# EAGLE schematic Circuit diagram (EAGLE 9.6.2)
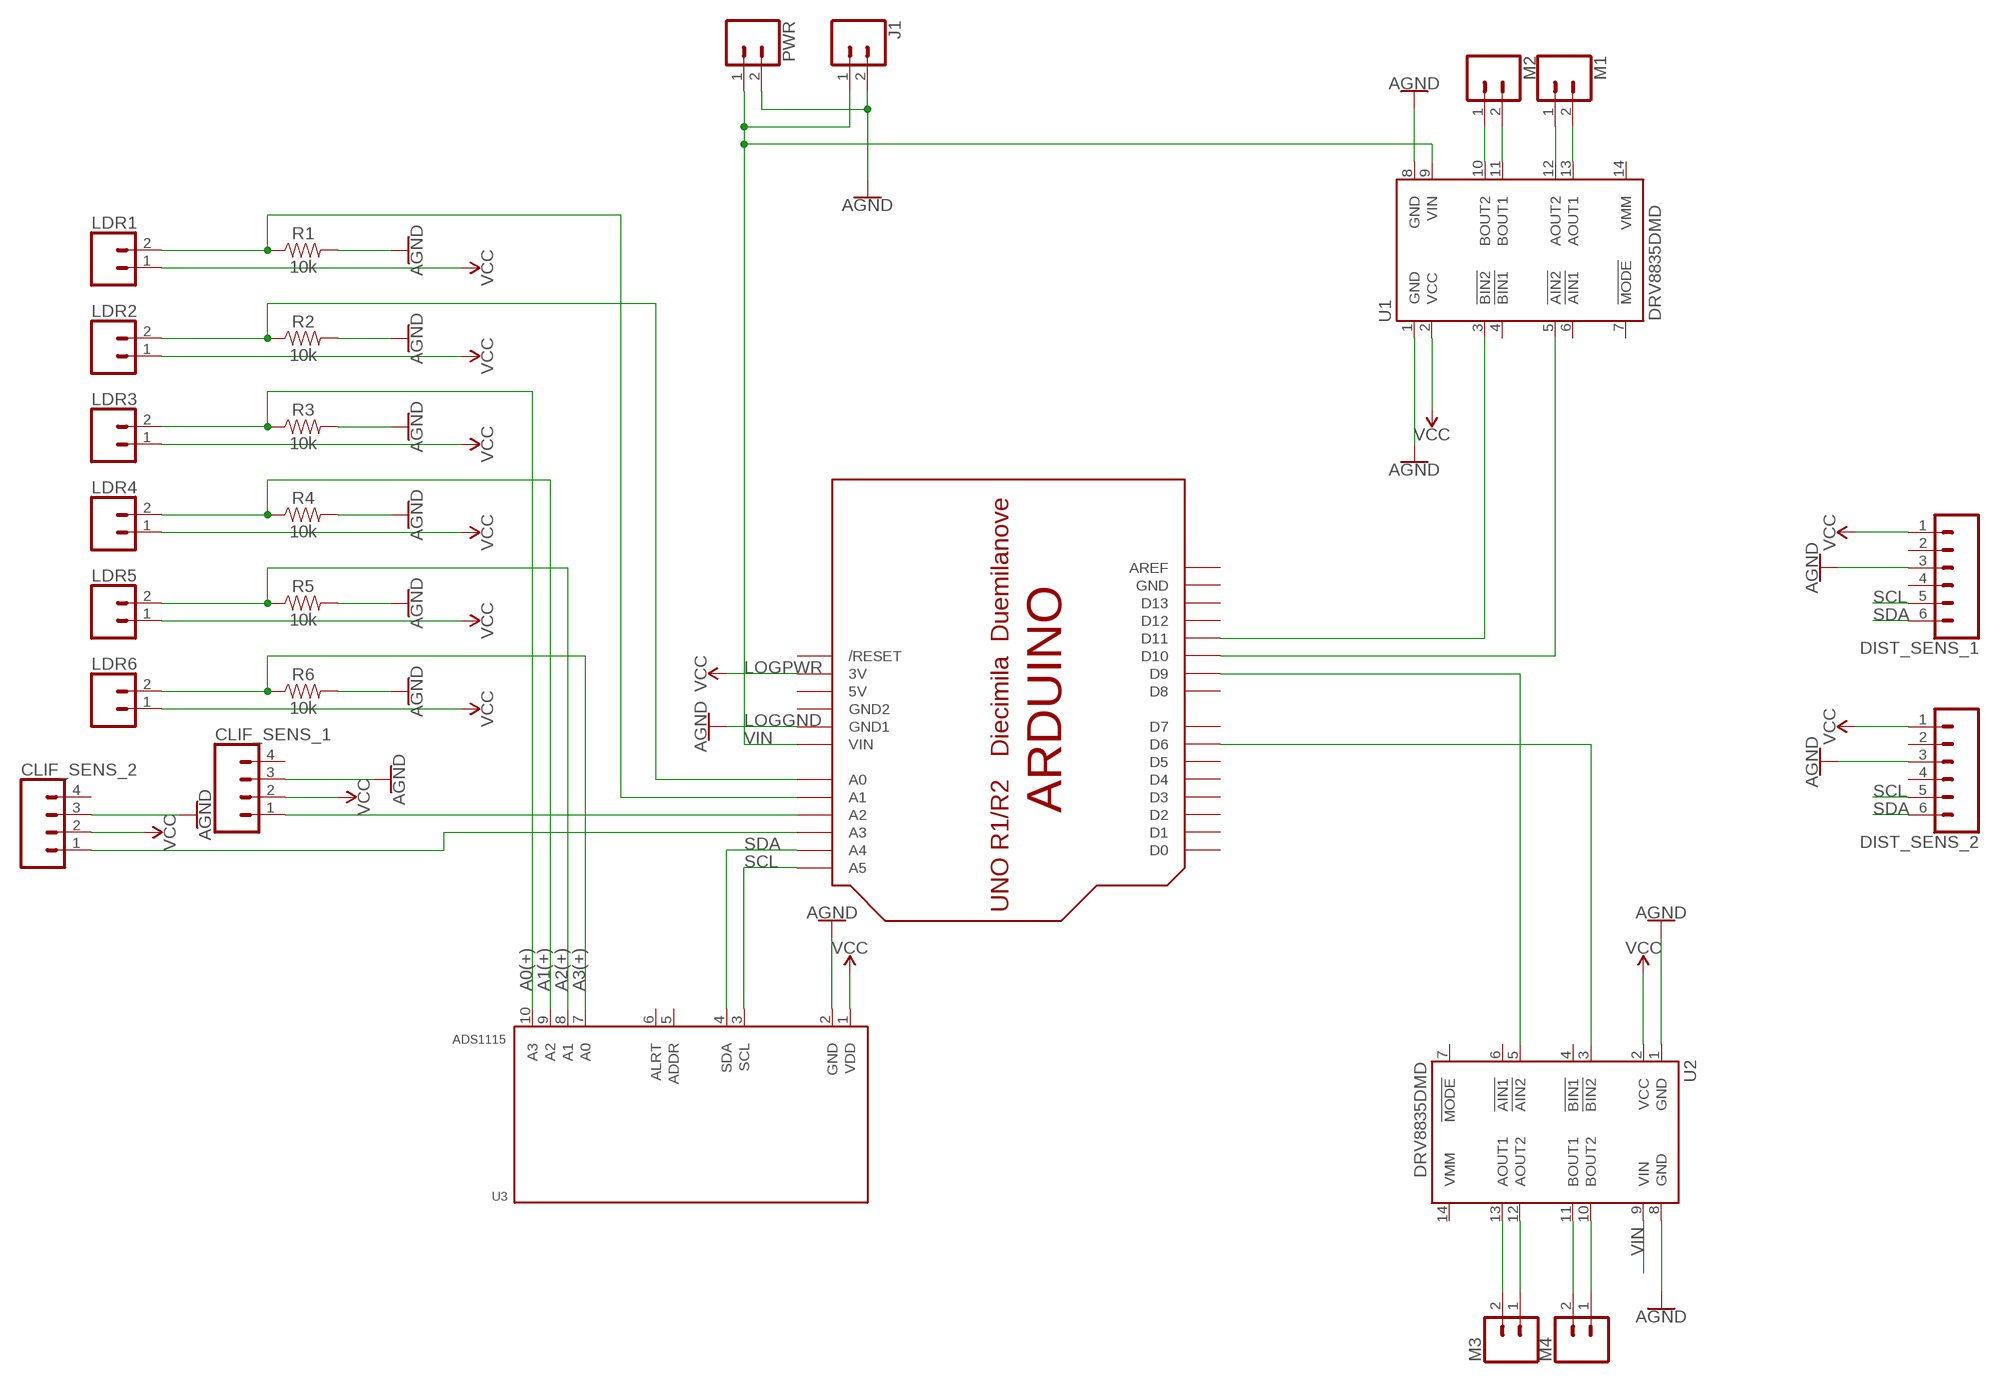
[diagram p0: schematic, sheet 1]

## Parts
CLIF_SENS_1  CONN_04JST-PTH  [JST-4-PTH]
CLIF_SENS_2  CONN_04JST-PTH  [JST-4-PTH]
DIST_SENS_1  CONN_06FEMALE_LOCK  [1X06_FEMALE_LOCK.010]
DIST_SENS_2  CONN_06FEMALE_LOCK  [1X06_FEMALE_LOCK.010]
J1  CONN_02  [1X02]
LDR1  CONN_02  [1X02]
LDR2  CONN_02  [1X02]
LDR3  CONN_02  [1X02]
LDR4  CONN_02  [1X02]
LDR5  CONN_02  [1X02]
LDR6  CONN_02  [1X02]
M1  CONN_02  [1X02]
M2  CONN_02  [1X02]
M3  CONN_02  [1X02]
M4  CONN_02  [1X02]
PWR  CONN_02  [1X02]
R1  10k  10KOHM-0402-1/16W-1%  [0402]
R2  10k  10KOHM-0402-1/16W-1%  [0402]
R3  10k  10KOHM-0402-1/16W-1%  [0402]
R4  10k  10KOHM-0402-1/16W-1%  [0402]
R5  10k  10KOHM-0402-1/16W-1%  [0402]
R6  10k  10KOHM-0402-1/16W-1%  [0402]
U1  DRV8835DMD  [DRV8835DMD]
U2  DRV8835DMD  [DRV8835DMD]
U3  ADS1115  [ADS1115]
U$1  ARDUINOUNO  [ARDUINO]

## Nets
A0(+): LDR3.2 R3.1 U3.10(A3)
A1(+): LDR4.2 R4.1 U3.9(A2)
A2(+): LDR5.2 R5.1 U3.8(A1)
A3(+): LDR6.2 R6.1 U3.7(A0)
AGND: CLIF_SENS_1.3 CLIF_SENS_2.3 DIST_SENS_1.3 DIST_SENS_2.3 J1.2 PWR.2 R1.2 R2.2 R3.2 R4.2 R5.2 R6.2 U1.1(GND) U1.8(GND) U2.1(GND) U2.8(GND) U3.2(GND)
LOGGND: U$1.GND1 ; supply symbol labelled AGND
LOGPWR: U$1.3V ; supply symbol labelled VCC
N$1: LDR1.2 R1.1 U$1.A1
N$2: LDR2.2 R2.1 U$1.A0
N$3: CLIF_SENS_1.1 U$1.A2
N$4: CLIF_SENS_2.1 U$1.A3
N$5: U1.3(!BIN2) U$1.D11
N$6: U1.5(!AIN2) U$1.D10
N$7: M3.2 U2.13(AOUT1)
N$8: M3.1 U2.12(AOUT2)
N$9: M4.2 U2.11(BOUT1)
N$10: M4.1 U2.10(BOUT2)
N$11: M1.2 U1.13(AOUT1)
N$12: M1.1 U1.12(AOUT2)
N$13: M2.2 U1.11(BOUT1)
N$14: M2.1 U1.10(BOUT2)
N$15: U2.5(!AIN2) U$1.D9
N$16: U2.3(!BIN2) U$1.D6
SCL: DIST_SENS_1.5 DIST_SENS_2.5 U3.3(SCL) U$1.A5
SDA: DIST_SENS_1.6 DIST_SENS_2.6 U3.4(SDA) U$1.A4
VCC: CLIF_SENS_1.2 CLIF_SENS_2.2 DIST_SENS_1.1 DIST_SENS_2.1 LDR1.1 LDR2.1 LDR3.1 LDR4.1 LDR5.1 LDR6.1 U1.2(VCC) U2.2(VCC) U3.1(VDD)
VIN: J1.1 PWR.1 U1.9(VIN) U2.9(VIN) U$1.VIN
Unconnected: CLIF_SENS_1.4 CLIF_SENS_2.4 DIST_SENS_1.2 DIST_SENS_1.4 DIST_SENS_2.2 DIST_SENS_2.4 U1.4(!BIN1) U1.6(!AIN1) U1.7(!MODE) U1.14(VMM) U2.4(!BIN1) U2.6(!AIN1) U2.7(!MODE) U2.14(VMM) U3.5(ADDR) U3.6(ALRT) U$1.AREF U$1.D0 U$1.D1 U$1.D2 U$1.D3 U$1.D4 U$1.D5 U$1.D7 U$1.D8 U$1.D12 U$1.D13 U$1.RESET(/RESET)

## Power pins joined to a net without a drawn wire
5V: U$1.5V
GND: U$1.GND
GND2: U$1.GND2

## Library data of the parts
CLIF_SENS_1 CLIF_SENS_2 = SparkFun-Connectors:CONN_04: Multi connection point. Often used as Generic Header-pin footprint for 0.1 inch spaced/style header connections On any of the 0.1 inch spaced packages, you can populate with these: Break Away Headers - Straight <https://www.sparkfun.com/products/116> (PRT-00116) Break Away Male Headers - Right Angle <https://www.sparkfun.com/products/553> (PRT-00553) Female Headers <https://www.sparkfun.com/products/115> (PRT-00115) Break Away Headers - Machine Pin <https://www.sparkfun.com/products/117> (PRT-00117) Break Away Female Headers - Swiss Machine Pin <https://www.sparkfun.com/products/743> (PRT-00743) For SCREWTERMINALS and SPRING TERMINALS visit here: Screw Terimnals on SparkFun.com <https://www.sparkfun.com/search/results?term=Screw+Terminals> (5mm/3.5mm/2.54mm spacing) This device is also useful as a general connection point to wire up your design to another part of your project. Our various solder wires solder well into these plated through hole pads. Hook-Up Wire - Assortment (Stranded, 22 AWG) <https://www.sparkfun.com/products/11375> (PRT-11375) Hook-Up Wire - Assortment (Solid Core, 22 AWG) <https://www.sparkfun.com/products/11367> (PRT-11367) View the entire wire category on our website here <https://www.sparkfun.com/categories/141> Special notes: Molex polarized connector foot print use with SKU : PRT-08231 with associated crimp pins and housings. 1MM SMD Version SKU: PRT-10208; PROD_ID: WIRE-13531; SF_ID: PRT-09916
DIST_SENS_1 DIST_SENS_2 = SparkFun-Connectors:CONN_06: Multi connection point. Often used as Generic Header-pin footprint for 0.1 inch spaced/style header connections On any of the 0.1 inch spaced packages, you can populate with these: Break Away Headers - Straight <https://www.sparkfun.com/products/116> (PRT-00116) Break Away Male Headers - Right Angle <https://www.sparkfun.com/products/553> (PRT-00553) Female Headers <https://www.sparkfun.com/products/115> (PRT-00115) Break Away Headers - Machine Pin <https://www.sparkfun.com/products/117> (PRT-00117) Break Away Female Headers - Swiss Machine Pin <https://www.sparkfun.com/products/743> (PRT-00743) Arduino Stackable Header - 6 Pin <https://www.sparkfun.com/products/9280> (PRT-09280) For SCREWTERMINALS and SPRING TERMINALS visit here: Screw Terimnals on SparkFun.com <https://www.sparkfun.com/search/results?term=Screw+Terminals> (5mm/3.5mm/2.54mm spacing) This device is also useful as a general connection point to wire up your design to another part of your project. Our various solder wires solder well into these plated through hole pads. Hook-Up Wire - Assortment (Stranded, 22 AWG) <https://www.sparkfun.com/products/11375> (PRT-11375) Hook-Up Wire - Assortment (Solid Core, 22 AWG) <https://www.sparkfun.com/products/11367> (PRT-11367) View the entire wire category on our website here <https://www.sparkfun.com/categories/141>
J1 LDR1-LDR6 M1-M4 PWR = SparkFun-Connectors:CONN_02: Multi connection point. Often used as Generic Header-pin footprint for 0.1 inch spaced/style header connections On any of the 0.1 inch spaced packages, you can populate with these: Break Away Headers - Straight <https://www.sparkfun.com/products/116> (PRT-00116) Break Away Male Headers - Right Angle <https://www.sparkfun.com/products/553> (PRT-00553) Female Headers <https://www.sparkfun.com/products/115> (PRT-00115) Break Away Headers - Machine Pin <https://www.sparkfun.com/products/117> (PRT-00117) Break Away Female Headers - Swiss Machine Pin <https://www.sparkfun.com/products/743> (PRT-00743) For SCREWTERMINALS and SPRING TERMINALS visit here: Screw Terimnals on SparkFun.com <https://www.sparkfun.com/search/results?term=Screw+Terminals> (5mm/3.5mm/2.54mm spacing) This device is also useful as a general connection point to wire up your design to another part of your project. Our various solder wires solder well into these plated through hole pads. Hook-Up Wire - Assortment (Stranded, 22 AWG) <https://www.sparkfun.com/products/11375> (PRT-11375) Hook-Up Wire - Assortment (Solid Core, 22 AWG) <https://www.sparkfun.com/products/11367> (PRT-11367) View the entire wire category on our website here <https://www.sparkfun.com/categories/141> Special notes: Molex polarized connector foot print use with: PRT-08233 with associated crimp pins and housings. 2.54_SCREWTERM for use with PRT-10571. 3.5mm Screw Terminal footprints for PRT-08084 5mm Screw Terminal footprints for use with PRT-08432
R1-R6 = SparkFun-Resistors:10KOHM: 10kΩ resistor A resistor is a passive two-terminal electrical component that implements electrical resistance as a circuit element. Resistors act to reduce current flow, and, at the same time, act to lower voltage levels within circuits. - Wikipedia; PROD_ID: RES-14241
U1 U2 = DRV8835:DRV8835DMD: This is the first device I made in eagle. It is the DRV8835 Duel Motor Driver Carrier: https://www.pololu.com/product/2135 I made this for my Sun Seeking Solar Robot project
U3 = ADS1115:ADS1115
U$1 = adafruit:ARDUINO: Arduino Diecimila/Duemilanove Make a shield with ease, this package has all the named pins as well as the two mounting drill holes and an outline of the USB and DC power connector. The outline is on the DIMENSION layer, so if your board house uses it they will cut the outline to match. http://www.ladyada.net/library/pcb/eaglelibrary.html